# EAGLE design power-carrier (EAGLE 6.2)
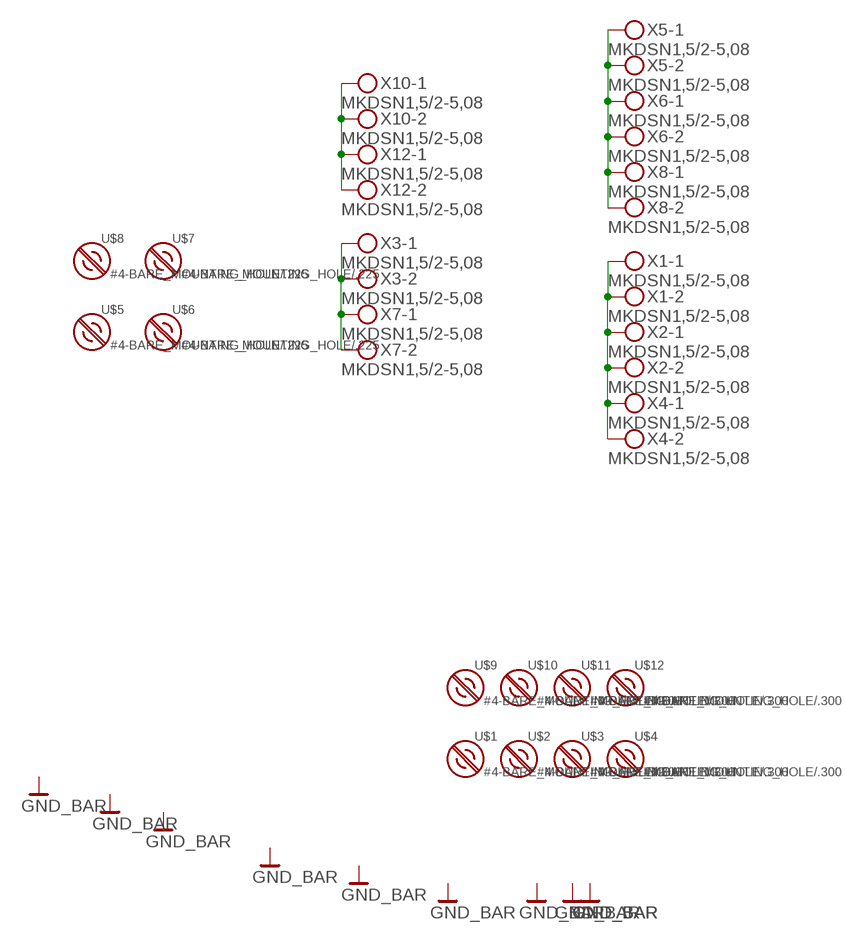
[diagram p0: schematic, sheet 1]

## Parts
U$1  #4-BARE_MOUNTING_HOLE/.300  [#4/.300-BARE+STD_NUT_OR_STAR_WASHER]
U$2  #4-BARE_MOUNTING_HOLE/.300  [#4/.300-BARE+STD_NUT_OR_STAR_WASHER]
U$3  #4-BARE_MOUNTING_HOLE/.300  [#4/.300-BARE+STD_NUT_OR_STAR_WASHER]
U$4  #4-BARE_MOUNTING_HOLE/.300  [#4/.300-BARE+STD_NUT_OR_STAR_WASHER]
U$5  #4-BARE_MOUNTING_HOLE/.225  [#4/.225-BARE+HEAD_OR_SMALL_NUT]
U$6  #4-BARE_MOUNTING_HOLE/.225  [#4/.225-BARE+HEAD_OR_SMALL_NUT]
U$7  #4-BARE_MOUNTING_HOLE/.225  [#4/.225-BARE+HEAD_OR_SMALL_NUT]
U$8  #4-BARE_MOUNTING_HOLE/.225  [#4/.225-BARE+HEAD_OR_SMALL_NUT]
U$9  #4-BARE_MOUNTING_HOLE/.300  [#4/.300-BARE+STD_NUT_OR_STAR_WASHER]
U$10  #4-BARE_MOUNTING_HOLE/.300  [#4/.300-BARE+STD_NUT_OR_STAR_WASHER]
U$11  #4-BARE_MOUNTING_HOLE/.300  [#4/.300-BARE+STD_NUT_OR_STAR_WASHER]
U$12  #4-BARE_MOUNTING_HOLE/.300  [#4/.300-BARE+STD_NUT_OR_STAR_WASHER]
X1  MKDSN1,5/2-5,08  [MKDSN1,5/2-5,08]
X2  MKDSN1,5/2-5,08  [MKDSN1,5/2-5,08]
X3  MKDSN1,5/2-5,08  [MKDSN1,5/2-5,08]
X4  MKDSN1,5/2-5,08  [MKDSN1,5/2-5,08]
X5  MKDSN1,5/2-5,08  [MKDSN1,5/2-5,08]
X6  MKDSN1,5/2-5,08  [MKDSN1,5/2-5,08]
X7  MKDSN1,5/2-5,08  [MKDSN1,5/2-5,08]
X8  MKDSN1,5/2-5,08  [MKDSN1,5/2-5,08]
X10  MKDSN1,5/2-5,08  [MKDSN1,5/2-5,08]
X12  MKDSN1,5/2-5,08  [MKDSN1,5/2-5,08]

## Nets
GND: X1.1 X1.2 X2.1 X2.2 X4.1 X4.2 X10.1 X10.2 X12.1 X12.2
VBAT: X3.1 X3.2 X5.1 X5.2 X6.1 X6.2 X7.1 X7.2 X8.1 X8.2

## Library data of the parts
U$1-U$12 = mount:#4-BARE_MOUNTING_HOLE: 1/8" drill hole for #4 screw mount
X1-X8 X10 X12 = con-phoenix-508:MKDSN1,5/2-5,08: MKDSN 1,5/ 2-5,08 Printklemme Nennstrom: 13,5 A Nennspannung: 250 V Rastermaß: 5,08 mm Polzahl: 2 Anschlussart: Schraubanschluss Montage: Löten Anschlussrichtung Leiter/Platine: 0 ° Artikelnummer: 1729128 Source: http://eshop.phoenixcontact.com .. 1729128.pdf; MPN: MKDSN 1,5/2-5.08; OC_FARNELL: 1792903; OC_NEWARK: 30M2397

## Board
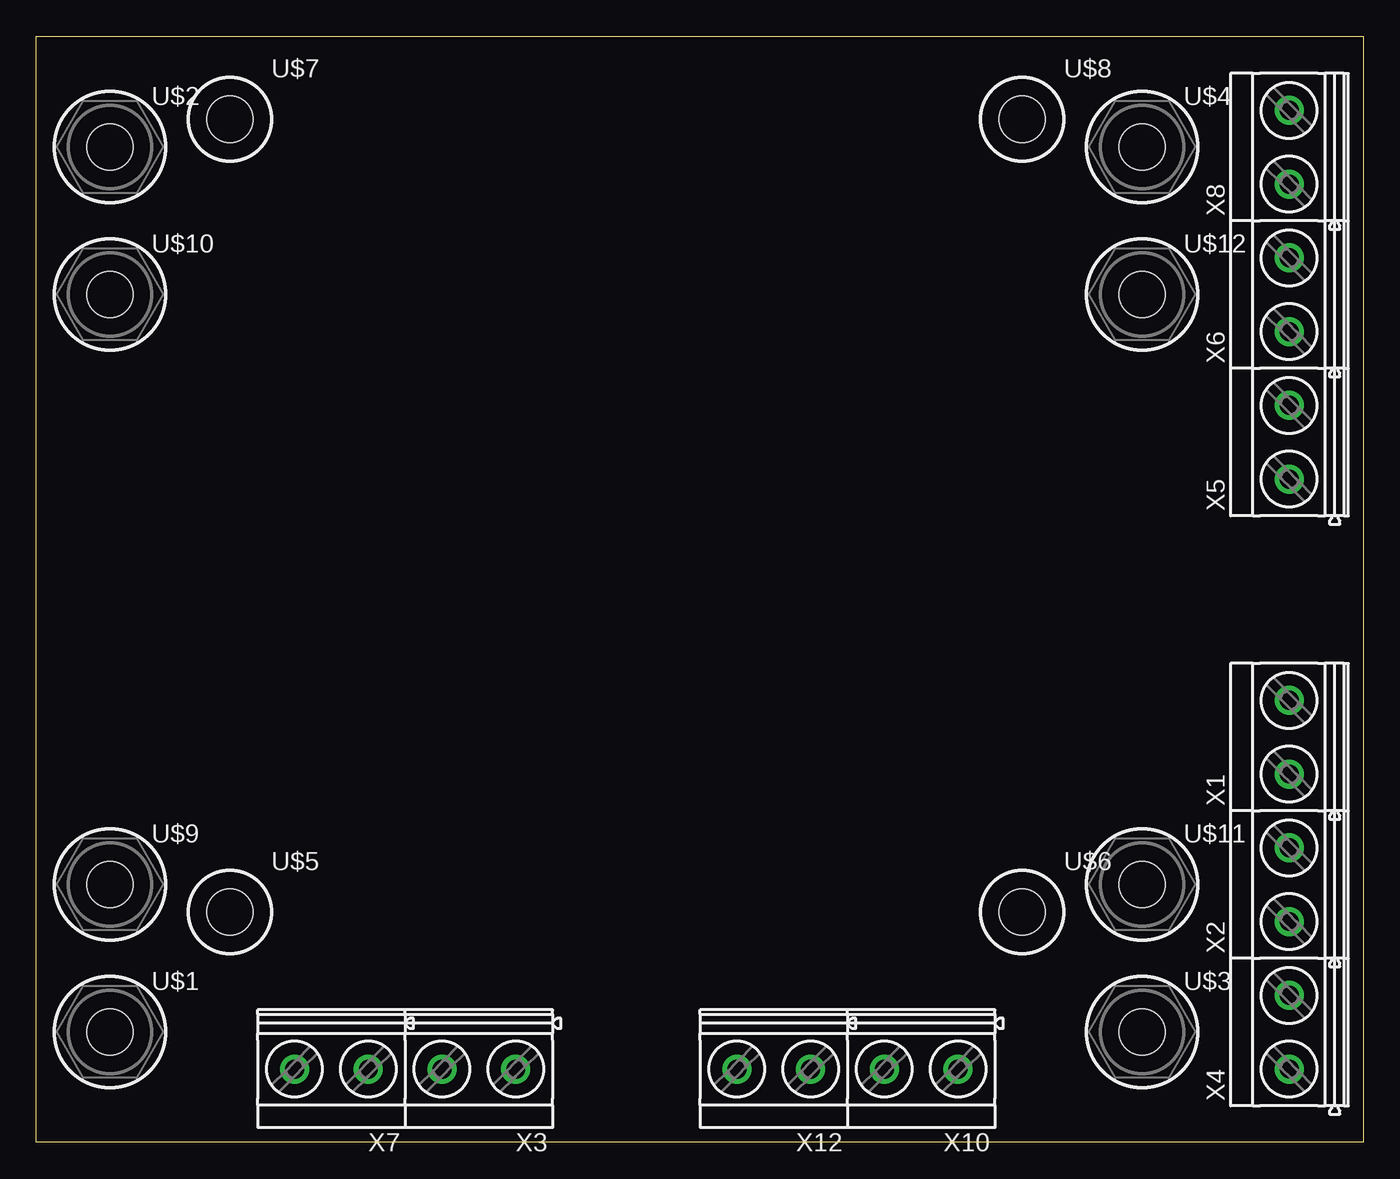
[diagram p1: board, top side]
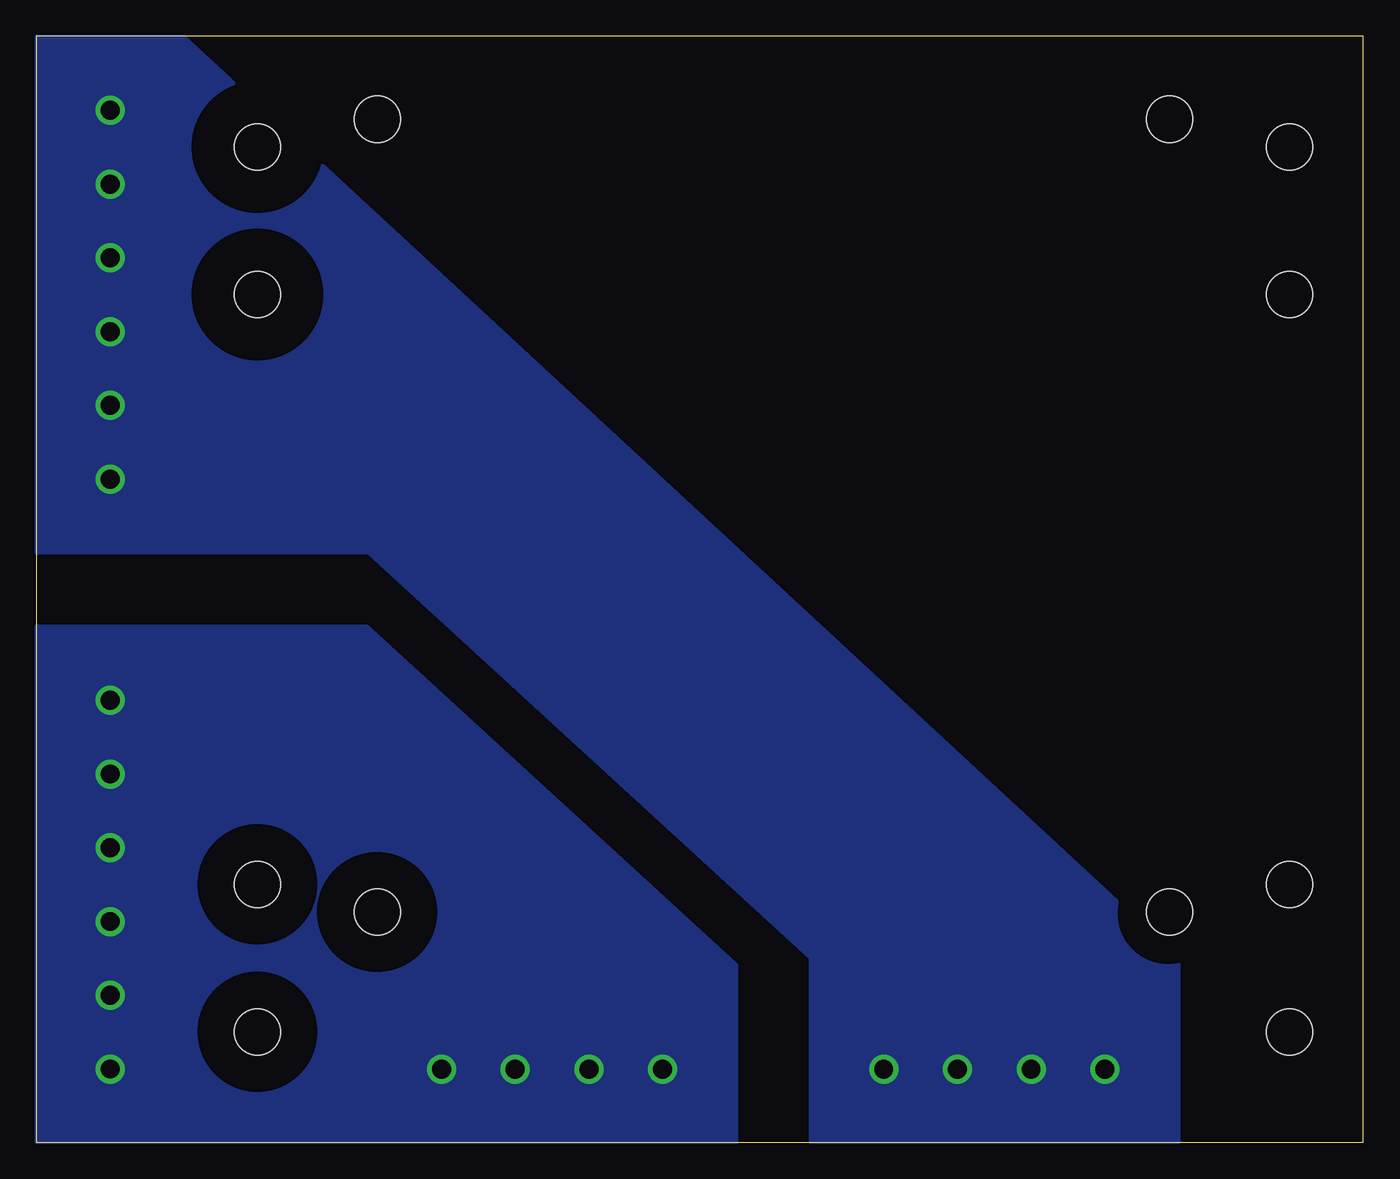
[diagram p2: board, bottom side, seen from below]

Size 91.44 x 76.2 mm. Coordinates in mm from the lower left corner, seen from the top.
Outline: 0,0 0,76.2 91.44,76.2 91.44,0 0,0
Copper layers (1*16): Top 0.035mm / dielectric 1.5mm / Bottom 0.035mm
Design rules: minimum track width 10mil, minimum drill 24mil, track to track 8mil, track to pad 8mil, pad to pad 8mil, via to via 8mil, smd to smd 8mil, copper to edge 0mil, drill to drill 8mil, minimum pad ring 10mil, minimum via ring 8mil, stop-mask expansion 4mil, vias tented up to drill 0mil, thermal gap 10mil
bRestrict: area 72.4,54.6 to 80,62.2; area 72.4,64.8 to 80,72.4; area 10.7,13 to 16.2,18.5

### Footprints (pad centres in the part's own frame; a part is rotated, then mirrored left to right if it is on the bottom)
#4/.300-BARE+STD_NUT_OR_STAR_WASHER = hole 3.175: 0,0
#4/.225-BARE+HEAD_OR_SMALL_NUT = hole 3.175: 0,0
MKDSN1,5/2-5,08 = drill 1.3 pad 2: 1 -2.561,0.025; 2 2.519,0.025

### Placement (x,y rotation side)
U$1  5.08,7.62 0 top
U$2  5.08,68.58 0 top
U$3  76.2,7.62 0 top
U$4  76.2,68.58 0 top
U$5  13.34,15.88 0 top
U$6  67.94,15.88 0 top
U$7  13.34,70.48 0 top
U$8  67.94,70.48 0 top
U$9  5.08,17.78 0 top
U$10  5.08,58.42 0 top
U$11  76.2,17.78 0 top
U$12  76.2,58.42 0 top
X1  86.36,27.94 90 top
X2  86.36,17.78 90 top
X3  30.48,5.08 180 top
X4  86.36,7.62 90 top
X5  86.36,48.26 90 top
X6  86.36,58.42 90 top
X7  20.32,5.08 180 top
X8  86.36,68.58 90 top
X10  60.96,5.08 180 top
X12  50.8,5.08 180 top

### Tracks (layer width: path | path; a pad name or v marks a point on that pad's centre or on a via)
GND
  pour Bottom (isolate 2.54, rank 4, no thermals): 91.44,35.56 91.44,0 43.18,0 43.18,35.56
VBAT
  pour Bottom (isolate 0.508, no thermals): 91.44,76.2 91.44,40.64 68.58,40.64 38.1,12.7 38.1,0 12.7,0 12.7,12.7 81.28,76.2 81.28,76.2

### Text on the board
Document: FRONT | REAR